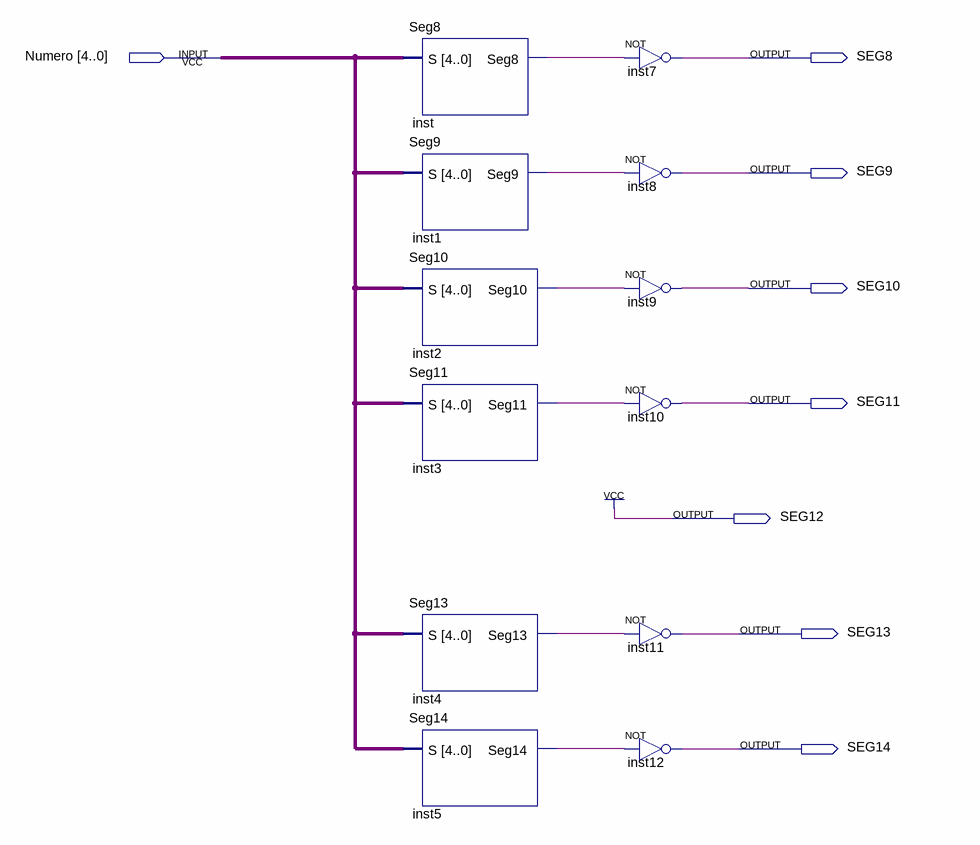
[diagram p0: schematic sheet]
// Quartus schematic Display_Dezenas.bdf as structural Verilog: 12 symbols, 8 pins
module Display_Dezenas (
  input  [4:0] Numero,
  output SEG8,
  output SEG9,
  output SEG10,
  output SEG11,
  output SEG12,
  output SEG13,
  output SEG14
);

  wire inst1_seg9, inst2_seg10, inst3_seg11, inst4_seg13, inst5_seg14, inst_seg8;

  Seg8 inst (.S(Numero), .Seg8(inst_seg8));
  Seg9 inst1 (.S(Numero), .Seg9(inst1_seg9));
  Seg10 inst2 (.S(Numero), .Seg10(inst2_seg10));
  Seg11 inst3 (.S(Numero), .Seg11(inst3_seg11));
  Seg13 inst4 (.S(Numero), .Seg13(inst4_seg13));
  Seg14 inst5 (.S(Numero), .Seg14(inst5_seg14));
  not inst7 (SEG8, inst_seg8);
  not inst8 (SEG9, inst1_seg9);
  not inst9 (SEG10, inst2_seg10);
  not inst10 (SEG11, inst3_seg11);
  not inst11 (SEG13, inst4_seg13);
  not inst12 (SEG14, inst5_seg14);

  assign SEG12 = 1'b1;
endmodule
